# Altium schematic sheet HBridge_Top_Level_1.SchDoc
size A; SheetNumber: 5; SheetTotal: 8
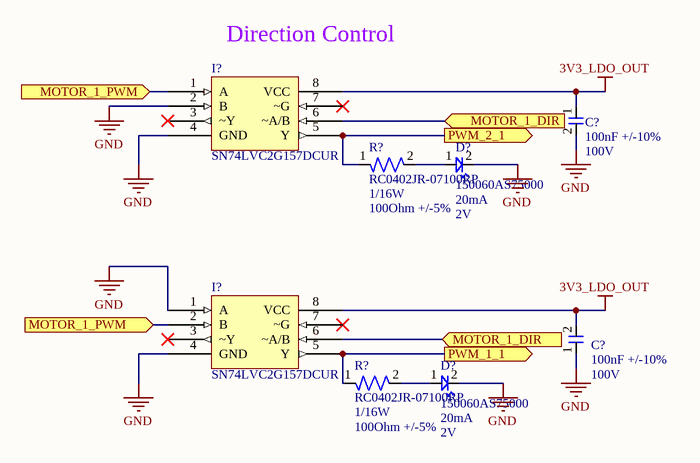
[diagram p0: HBridge_Top_Level_1.SchDoc]

## Parts
(Parts that share a designator on the sheet are numbered #1, #2 ... from top to bottom, then left to right.)
C?#1  Capacitance: 100nF +/-10%  Voltage Rating: 100V  [CAP-0603]  (hidden comment: CC0603KRX7R0BB104)
C?#2  Capacitance: 100nF +/-10%  Voltage Rating: 100V  [CAP-0603]  (hidden comment: CC0603KRX7R0BB104)
D?#1  150060AS75000  Current Rating: 20mA  Vf: 2V  [LED-0603]
D?#2  150060AS75000  Current Rating: 20mA  Vf: 2V  [LED-0603]
I?#1  SN74LVC2G157DCUR  [IC-MUX-8VSSOP]
I?#2  SN74LVC2G157DCUR  [IC-MUX-8VSSOP]
R?#1  RC0402JR-07100RP  Power Rating: 1/16W  Resistance: 100Ohm +/-5%  [RES-0402]
R?#2  RC0402JR-07100RP  Power Rating: 1/16W  Resistance: 100Ohm +/-5%  [RES-0402]

## Ports
MOTOR_1_DIR (in, see HBridge_Top_Level_1[3B], MCU_CAN[4C]), MOTOR_1_DIR (in, see HBridge_Top_Level_1[3C], MCU_CAN[4C]), MOTOR_1_PWM (in, see HBridge_Top_Level_1[2B], MCU_CAN[4C]), MOTOR_1_PWM (in, see HBridge_Top_Level_1[2C], MCU_CAN[4C]), PWM_1_1 (out), PWM_2_1 (out)

## Nets
3V3_LDO_OUT: C?#1.1 C?#2.2 I?#1.8(VCC) I?#2.8(VCC)
GND: C?#1.2 C?#2.1 D?#1.2 D?#2.2 I?#1.2(B) I?#1.4(GND) I?#2.1(A) I?#2.4(GND)
MOTOR_1_DIR: I?#1.6(~A/B) I?#2.6(~A/B) ; port MOTOR_1_DIR
MOTOR_1_PWM: I?#1.1(A) I?#2.2(B) ; port MOTOR_1_PWM
PWM_1_1: I?#2.5(Y) R?#2.1 ; port PWM_1_1
PWM_2_1: I?#1.5(Y) R?#1.1 ; port PWM_2_1
NetD?#1_1: D?#1.1 R?#1.2
NetD?#2_1: D?#2.1 R?#2.2

Not connected (* = marked no-connect by the designer): I?#1 3(~Y)* 7(~G)*; I?#2 3(~Y)* 7(~G)*

## Notes on the sheet
- (near I?#1) Direction Control

## Library data of the parts
C?#1 C?#2 = CAP-100N-0001: CAP CER 0.1UF 100V X7R 0603; Manufacturer: YAGEO; Assembled?: no; Manufacturer Part Number: CC0603KRX7R0BB104; Temperature Coefficient: X7R; Package Size: 0603
D?#1 D?#2 = LED_Amber_0001: CAP CER 0.1UF 100V X7R 0603; Manufacturer: Wurth Electronik; Assembled?: no; Color: Amber; Manufacturer Part Number: 150060AS75000; Package Size: 0603
I?#1 = IC-MUX-0001
I?#2 = IC-MUX-0001: Multiplexer 1 x 2:1 8-VSSOP; Vin: 1.65-5.5V
R?#1 R?#2 = RES-100-0001: RES SMD 100 OHM 5% 1/16W 0402; Manufacturer: YAGEO; Assembled?: no; Manufacturer Part Number: RC0402JR-07100RP; Package Size: 0402